# EAGLE schematic IR PCB Schematic (EAGLE 9.6.2)
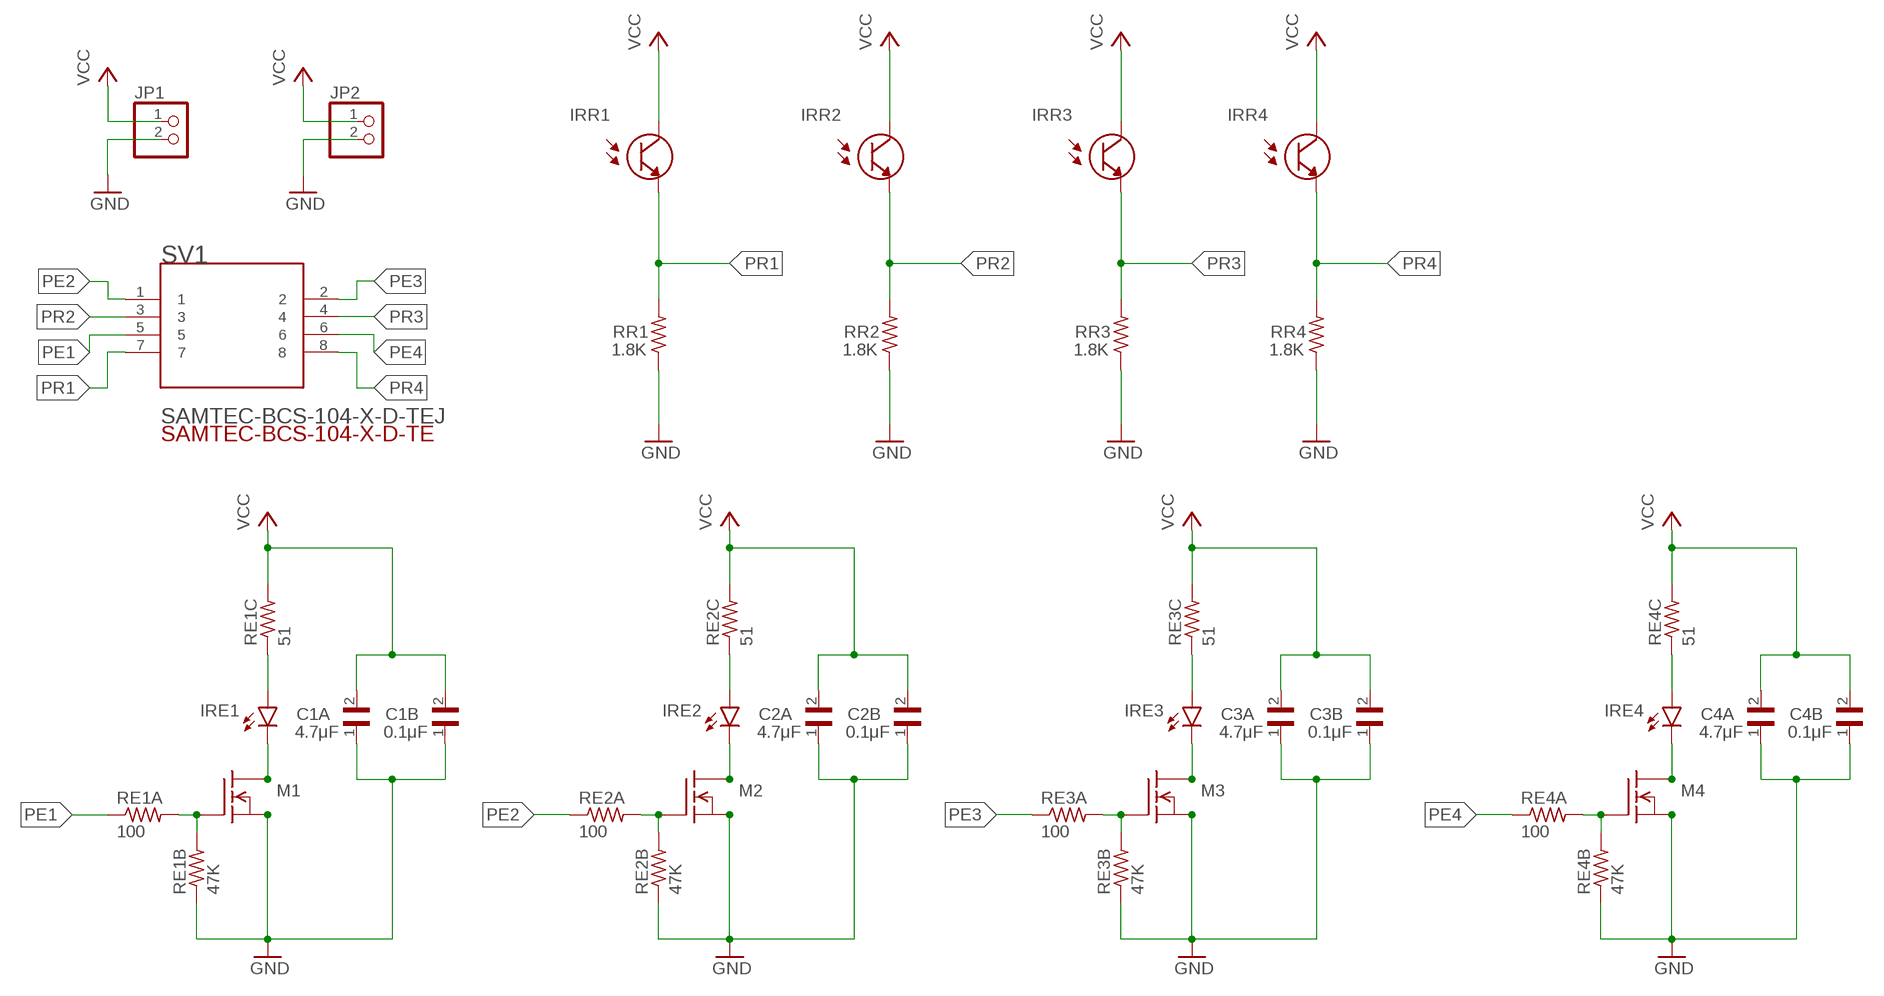
[diagram p0: schematic, sheet 1]

## Parts
C1A  4.7μF  GRM21BR71A106KA73L  [CAPC2012X140N]
C1B  0.1μF  GRM21BR71A106KA73L  [CAPC2012X140N]
C2A  4.7μF  GRM21BR71A106KA73L  [CAPC2012X140N]
C2B  0.1μF  GRM21BR71A106KA73L  [CAPC2012X140N]
C3A  4.7μF  GRM21BR71A106KA73L  [CAPC2012X140N]
C3B  0.1μF  GRM21BR71A106KA73L  [CAPC2012X140N]
C4A  4.7μF  GRM21BR71A106KA73L  [CAPC2012X140N]
C4B  0.1μF  GRM21BR71A106KA73L  [CAPC2012X140N]
IRE1  LED5MM  [LED5MM]
IRE2  LED5MM  [LED5MM]
IRE3  LED5MM  [LED5MM]
IRE4  LED5MM  [LED5MM]
IRR1  SFH_313_FA-3/4  [XDCR_SFH_313_FA-3/4]
IRR2  SFH_313_FA-3/4  [XDCR_SFH_313_FA-3/4]
IRR3  SFH_313_FA-3/4  [XDCR_SFH_313_FA-3/4]
IRR4  SFH_313_FA-3/4  [XDCR_SFH_313_FA-3/4]
JP1  PINHD-1X2  [1X02]
JP2  PINHD-1X2  [1X02]
M1  2N7002  [SOT23]
M2  2N7002  [SOT23]
M3  2N7002  [SOT23]
M4  2N7002  [SOT23]
RE1A  100  R-US_R0805  [R0805]
RE1B  47K  R-US_R0805  [R0805]
RE1C  51  R-US_R0805  [R0805]
RE2A  100  R-US_R0805  [R0805]
RE2B  47K  R-US_R0805  [R0805]
RE2C  51  R-US_R0805  [R0805]
RE3A  100  R-US_R0805  [R0805]
RE3B  47K  R-US_R0805  [R0805]
RE3C  51  R-US_R0805  [R0805]
RE4A  100  R-US_R0805  [R0805]
RE4B  47K  R-US_R0805  [R0805]
RE4C  51  R-US_R0805  [R0805]
RR1  1.8K  R-US_R0805  [R0805]
RR2  1.8K  R-US_R0805  [R0805]
RR3  1.8K  R-US_R0805  [R0805]
RR4  1.8K  R-US_R0805  [R0805]
SV1  SAMTEC-BCS-104-X-D-TEJ  [SAMTEC-BCS-104-X-D-TE]

## Nets
GND: C1A.1 C1B.1 C2A.1 C2B.1 C3A.1 C3B.1 C4A.1 C4B.1 JP1.2 JP2.2 M1.2(S) M2.2(S) M3.2(S) M4.2(S) RE1B.1 RE2B.1 RE3B.1 RE4B.1 RR1.1 RR2.1 RR3.1 RR4.1
N$1: M1.1(G) RE1A.2 RE1B.2
N$2: IRE1.A RE1C.1
N$3: M2.1(G) RE2A.2 RE2B.2
N$4: IRE2.A RE2C.1
N$5: IRE1.K(C) M1.3(D)
N$6: IRE2.K(C) M2.3(D)
N$7: M3.1(G) RE3A.2 RE3B.2
N$8: IRE3.A RE3C.1
N$9: IRE3.K(C) M3.3(D)
N$10: M4.1(G) RE4A.2 RE4B.2
N$11: IRE4.A RE4C.1
N$12: IRE4.K(C) M4.3(D)
PE1: RE1A.1 SV1.5
PE2: RE2A.1 SV1.1
PE3: RE3A.1 SV1.2
PE4: RE4A.1 SV1.6
PR1: IRR1.1(E) RR1.2 SV1.7
PR2: IRR2.1(E) RR2.2 SV1.3
PR3: IRR3.1(E) RR3.2 SV1.4
PR4: IRR4.1(E) RR4.2 SV1.8
VCC: C1A.2 C1B.2 C2A.2 C2B.2 C3A.2 C3B.2 C4A.2 C4B.2 IRR1.2(C) IRR2.2(C) IRR3.2(C) IRR4.2(C) JP1.1 JP2.1 RE1C.2 RE2C.2 RE3C.2 RE4C.2

## Library data of the parts
C1A C1B C2A C2B C3A C3B C4A C4B = GRM21BR71A106KA73L:GRM21BR71A106KA73L: SMD Capacitor X7R(EIA) with Capacitance: 10uF Tol. 10%. Rated Voltage: 10Vdc; DESCRIPTION: SMD capacitor X7R(EIA) with capacitance 10uF Tol.10%. Rated voltage 10Vdc 125C; DIGI-KEY_PART_NUMBER: 490-10516-1-ND; MF: Murata Electronics; MP: GRM21BR71A106KA73L; PACKAGE: 2012 Murata; PURCHASE-URL: https://pricing.snapeda.com/search/part/GRM21BR71A106KA73L/?ref=eda
IRE1-IRE4 = led:LED: LED OSRAM: - CHIPLED LG R971, LG N971, LY N971, LG Q971, LY Q971, LO R971, LY R971 LH N974, LH R974 LS Q976, LO Q976, LY Q976 LO Q996 - Hyper CHIPLED LW Q18S LB Q993, LB Q99A, LB R99A - SideLED LS A670, LO A670, LY A670, LG A670, LP A670 LB A673, LV A673, LT A673, LW A673 LH A674 LY A675 LS A676, LA A676, LO A676, LY A676, LW A676 LS A679, LY A679, LG A679 - Hyper Micro SIDELED® LS Y876, LA Y876, LO Y876, LY Y876 LT Y87S - SmartLED LW L88C, LW L88S LB L89C, LB L89S, LG L890 LS L89K, LO L89K, LY L89K LS L896, LA L896, LO L896, LY L896 - TOPLED LS T670, LO T670, LY T670, LG T670, LP T670 LSG T670, LSP T670, LSY T670, LOP T670, LYG T670 LG T671, LOG T671, LSG T671 LB T673, LV T673, LT T673, LW T673 LH T674 LS T676, LA T676, LO T676, LY T676, LB T676, LH T676, LSB T676, LW T676 LB T67C, LV T67C, LT T67C, LS T67K, LO T67K, LY T67K, LW E67C LS E67B, LA E67B, LO E67B, LY E67B, LB E67C, LV E67C, LT E67C LW T67C LS T679, LY T679, LG T679 LS T770, LO T770, LY T770, LG T770, LP T770 LB T773, LV T773, LT T773, LW T773 LH T774 LS E675, LA E675, LY E675, LS T675 LS T776, LA T776, LO T776, LY T776, LB T776 LHGB T686 LT T68C, LB T68C - Hyper Mini TOPLED® LB M676 - Mini TOPLED Santana® LG M470 LS M47K, LO M47K, LY M47K Source: http://www.osram.convergy.de LUXEON: - LUMILED® LXK2-PW12-R00, LXK2-PW12-S00, LXK2-PW14-U00, LXK2-PW14-V00 LXK2-PM12-R00, LXK2-PM12-S00, LXK2-PM14-U00 LXK2-PE12-Q00, LXK2-PE12-R00, LXK2-PE12-S00, LXK2-PE14-T00, LXK2-PE14-U00 LXK2-PB12-K00, LXK2-PB12-L00, LXK2-PB12-M00, LXK2-PB14-N00, LXK2-PB14-P00, LXK2-PB14-Q00 LXK2-PR12-L00, LXK2-PR12-M00, LXK2-PR14-Q00, LXK2-PR14-R00 LXK2-PD12-Q00, LXK2-PD12-R00, LXK2-PD12-S00 LXK2-PH12-R00, LXK2-PH12-S00 LXK2-PL12-P00, LXK2-PL12-Q00, LXK2-PL12-R00 Source: www.luxeon.com KINGBRIGHT: KA-3528ASYC Source: www.kingbright.com
IRR1-IRR4 = SFH_313_FA-3_4:SFH_313_FA-3/4: Phototransistor IR Chip Silicon 870nm 2-Pin T-1 3/4; AVAILABILITY: Unavailable; DESCRIPTION: Phototransistors 870nm Top View Radial - 2 Leads; MF: OSRAM Opto; MP: SFH 313 FA-3/4; PACKAGE: Radial-2 Osram Opto; PRICE: None
JP1 JP2 = pinhead:PINHD-1X2: PIN HEADER
M1-M4 = 2N7002:2N7002: Check prices <https://pricing.snapeda.com/parts/2N7002/ON%20Semiconductor/view-part?ref=eda>; AVAILABILITY: Good; DESCRIPTION: N-Channel 60V 260mA (Ta) 300mW (Tj) Surface Mount SOT-23-3 (TO-236); MF: ON Semiconductor; MP: 2N7002; PACKAGE: SOT-23-3 ON Semiconductor; PRICE: None; PURCHASE-URL: https://pricing.snapeda.com/search/part/2N7002/?ref=eda
RE1A RE1B RE1C RE2A RE2B RE2C RE3A RE3B RE3C RE4A RE4B RE4C RR1-RR4 = rcl:R-US_: RESISTOR, American symbol; SPICEPREFIX: R
SV1 = SAMTEC-BCS-104-X-D-TE:SAMTEC-BCS-104-X-D-TE: Check prices <https://pricing.snapeda.com/parts/BCS-104-T-D-TE/Samtec/view-part?ref=eda>; AVAILABILITY: Bad; DESCRIPTION: 8 Position Receptacle Connector Through Hole; MF: Samtec; MP: BCS-104-T-D-TE; PACKAGE: None; PRICE: None; PURCHASE-URL: https://pricing.snapeda.com/search/part/BCS-104-T-D-TE/?ref=eda